# EAGLE schematic main (EAGLE 9.6.2)
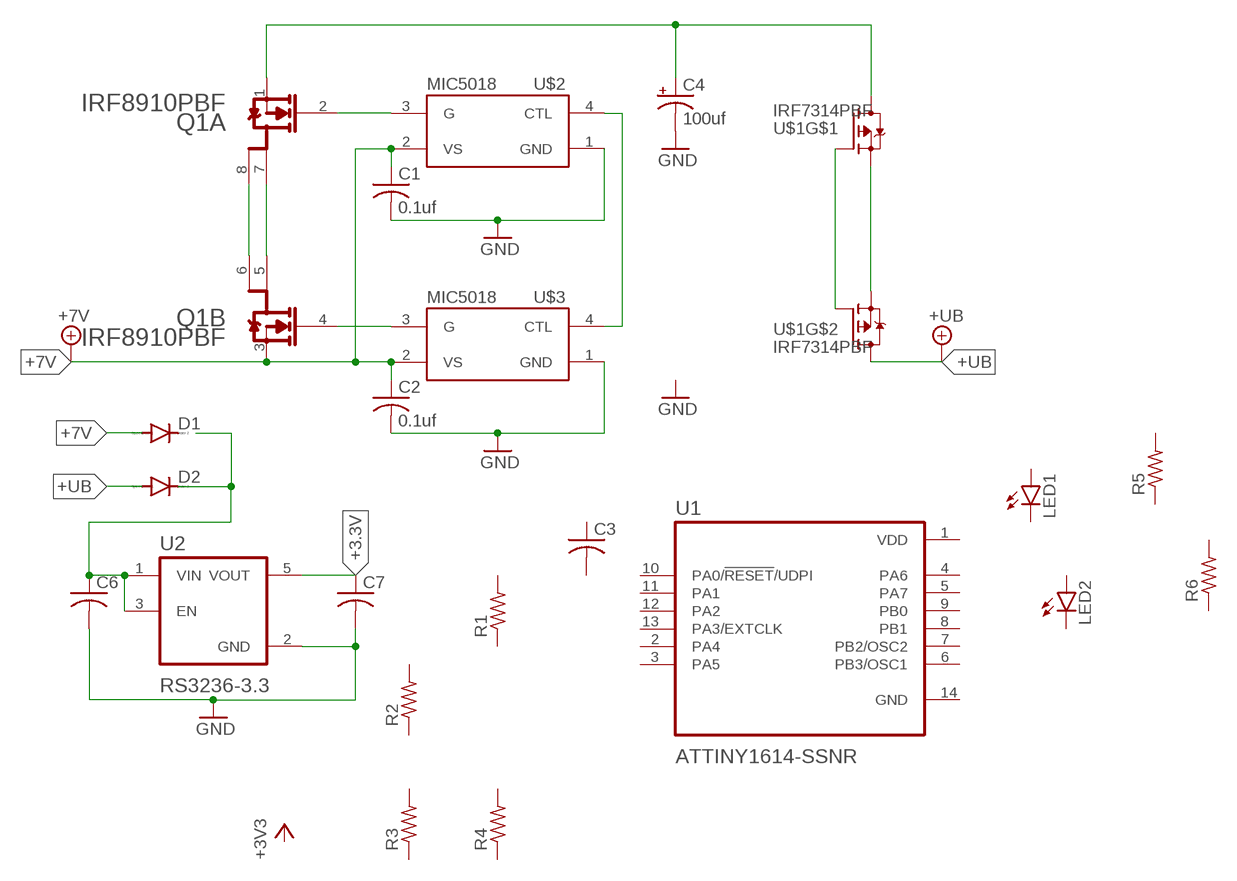
[diagram p0: schematic, sheet 1]

## Parts
C1  0.1uf  C-USC0805  [C0805]
C2  0.1uf  C-USC0805  [C0805]
C3  C-USC0805  [C0805]
C4  100uf  CPOL-US153CLV-0605  [153CLV-0605]
C6  C-USC1210  [C1210]
C7  C-USC1210  [C1210]
D1  DIODE-SOD323-W  [SOD323-W]
D2  DIODE-SOD323-W  [SOD323-W]
LED1  LED5MM  [LED5MM]
LED2  LED5MM  [LED5MM]
Q1  j  INFINEON_IRF8910PBFINFINEON_IRF8910PBF_0_0  [INFINEON_IRF8910PBF_0]
R1  R-US_R0805  [R0805]
R2  R-US_R0805  [R0805]
R3  R-US_R0805  [R0805]
R4  R-US_R0805  [R0805]
R5  R-US_R0805  [R0805]
R6  R-US_R0805  [R0805]
U1  ATTINY1614-SSNR  [SOIC127P600X175-14N]
U2  RS3236-3.3  AP2112K-3.3TRG1  [SOT95P285X140-5N]
U$1  IRF7314PBF  [SO-8]
U$2  MIC5018  [SOT143]
U$3  MIC5018  [SOT143]

## Nets
+3.3V: C7.1 U2.5(VOUT)
+7V: C1.1 C2.1 D1.A Q1.3(B:S2) U$2.2(VS) U$3.2(VS)
+UB: D2.A U$1.5(D) U$1.6(D)
GND: C1.2 C2.2 C4.- C6.2 C7.2 U2.2(GND) U$2.1(GND) U$3.1(GND)
N$1: C4.+ Q1.1(A:S1) U$1.7(D) U$1.8(D)
N$3: Q1.4(B:G2) U$3.3(G)
N$4: Q1.2(A:G1) U$2.3(G)
N$5: Q1.5(B:1_D2) Q1.7(A:1_D1)
N$6: Q1.6(B:2_D2) Q1.8(A:2_D1)
N$7: U$2.4(CTL) U$3.4(CTL)
N$8: U$1.1(S) U$1.3(S)
N$9: U$1.2(G) U$1.4(G)
N$10: C6.1 D2.C U2.1(VIN) U2.3(EN)
Unconnected: C3.1 C3.2 D1.C LED1.A LED1.K(C) LED2.A LED2.K(C) R1.1 R1.2 R2.1 R2.2 R3.1 R3.2 R4.1 R4.2 R5.1 R5.2 R6.1 R6.2 U1.2(PA4) U1.3(PA5) U1.4(PA6) U1.5(PA7) U1.6(PB3/OSC1) U1.7(PB2/OSC2) U1.8(PB1) U1.9(PB0) U1.10(PA0/!RESET!/UDPI) U1.11(PA1) U1.12(PA2) U1.13(PA3/EXTCLK)

## Power pins joined to a net without a drawn wire
GND: U1.14(GND)
VDD: U1.1(VDD)

## Library data of the parts
C1-C3 C6 C7 = rcl:C-US: CAPACITOR, American symbol; SPICEPREFIX: C
C4 = rcl:CPOL-US: POLARIZED CAPACITOR, American symbol; SPICEPREFIX: C
D1 D2 = diode:DIODE-: DIODE
LED1 LED2 = led:LED: LED OSRAM: - CHIPLED LG R971, LG N971, LY N971, LG Q971, LY Q971, LO R971, LY R971 LH N974, LH R974 LS Q976, LO Q976, LY Q976 LO Q996 - Hyper CHIPLED LW Q18S LB Q993, LB Q99A, LB R99A - SideLED LS A670, LO A670, LY A670, LG A670, LP A670 LB A673, LV A673, LT A673, LW A673 LH A674 LY A675 LS A676, LA A676, LO A676, LY A676, LW A676 LS A679, LY A679, LG A679 - Hyper Micro SIDELED® LS Y876, LA Y876, LO Y876, LY Y876 LT Y87S - SmartLED LW L88C, LW L88S LB L89C, LB L89S, LG L890 LS L89K, LO L89K, LY L89K LS L896, LA L896, LO L896, LY L896 - TOPLED LS T670, LO T670, LY T670, LG T670, LP T670 LSG T670, LSP T670, LSY T670, LOP T670, LYG T670 LG T671, LOG T671, LSG T671 LB T673, LV T673, LT T673, LW T673 LH T674 LS T676, LA T676, LO T676, LY T676, LB T676, LH T676, LSB T676, LW T676 LB T67C, LV T67C, LT T67C, LS T67K, LO T67K, LY T67K, LW E67C LS E67B, LA E67B, LO E67B, LY E67B, LB E67C, LV E67C, LT E67C LW T67C LS T679, LY T679, LG T679 LS T770, LO T770, LY T770, LG T770, LP T770 LB T773, LV T773, LT T773, LW T773 LH T774 LS E675, LA E675, LY E675, LS T675 LS T776, LA T776, LO T776, LY T776, LB T776 LHGB T686 LT T68C, LB T68C - Hyper Mini TOPLED® LB M676 - Mini TOPLED Santana® LG M470 LS M47K, LO M47K, LY M47K Source: http://www.osram.convergy.de LUXEON: - LUMILED® LXK2-PW12-R00, LXK2-PW12-S00, LXK2-PW14-U00, LXK2-PW14-V00 LXK2-PM12-R00, LXK2-PM12-S00, LXK2-PM14-U00 LXK2-PE12-Q00, LXK2-PE12-R00, LXK2-PE12-S00, LXK2-PE14-T00, LXK2-PE14-U00 LXK2-PB12-K00, LXK2-PB12-L00, LXK2-PB12-M00, LXK2-PB14-N00, LXK2-PB14-P00, LXK2-PB14-Q00 LXK2-PR12-L00, LXK2-PR12-M00, LXK2-PR14-Q00, LXK2-PR14-R00 LXK2-PD12-Q00, LXK2-PD12-R00, LXK2-PD12-S00 LXK2-PH12-R00, LXK2-PH12-S00 LXK2-PL12-P00, LXK2-PL12-Q00, LXK2-PL12-R00 Source: www.luxeon.com KINGBRIGHT: KA-3528ASYC Source: www.kingbright.com
Q1 = Infineon - IRF8910PBF:INFINEON_IRF8910PBF: Mosfet Array 2 N-Channel (Dual) 20V 10A 2W Surface Mount 8-SO; AUTOMOTIVE: No; CENTROID_NOT_SPECIFIED: No; CONTINUOUS_DRAIN_CURRENT: 10A; DATASHEET: https://www.infineon.com/dgdl/irf8910pbf.pdf?fileId=5546d462533600a401535610ec101d8d; DEPLETION_MODE: False; DEVICE_CLASS_L1: Discrete Semiconductors; DEVICE_CLASS_L2: Transistors; DEVICE_CLASS_L3: MOSFETs; DIGIKEY_DESCRIPTION: MOSFET 2N-CH 20V 10A 8-SOIC; DIGIKEY_PART_NUMBER: IRF8910PBF-ND; DRAIN_TO_SOURCE_BREAKDOWN_VOLTAGE: 20V; DRAIN_TO_SOURCE_RESISTANCE: 14.6mΩ; DRAIN_TO_SOURCE_VOLTAGE: 20V; FOOTPRINT_PARAMETERS_1: {"fp_type":"SOIC_narrow","params":{"N":{"nom":"8","long name":"Number of leads","min":null,"max":null,"short name":"N","type":"count"},"A":{"nom":false,"long name":"Height","min":1350000,"max":1750000,"short name":"A","type":"measurement"},"A1":{"nom":false,"long name":"Package clearance","min":100000,"max":250000,"short name":"A1","type":"measurement"},"A2":{"nom":false,"long name":"Package height","min":false,"max":1500000,"short name":"A2","type":"measurement"},"D":{"nom":false,"long name":"Package length","min":4800000,"max":5000000,"short name":"D","type":"measurement"},"E":{"nom":false,"long name":"Width w/ leads","min":5800000,"max":6200000,"short name":"E","type":"measurement"},"E1":{"nom":false,"long name":"Package width","min":3800000,"max":4000000,"short name":"E1","type":"measurement"},"B":{"nom":false,"long name":"Lead width","min":330000,"max":510000,"short name":"B","type":"measurement"},"C":{"nom":false,"long name":"Lead thickness","min":190000,"max":250000,"short name":"C","type":"measurement"},"e":{"nom":1270000,"long name":"Lead pitch","min":null,"max":null,"short name":"e","type":"measurement"},"L":{"nom":false,"long name":"Lead foot length","min":400000,"max":1270000,"short name":"L","type":"measurement"},"PHI":{"nom":false,"long name":"Lead foot angle","min":0,"max":8000000,"short name":"PHI","type":"measurement"},"HT":{"default":"No","long name":"Thermal pad","type":"multichoiceparent","short name":"HT","children":[]},"offset x":{"nom":0,"long name":"X Center offset","min":null,"max":null,"short name":"offset x","type":"measurement"},"offset y":{"nom":0,"long name":"Y Center offset","min":null,"max":null,"short name":"offset y","type":"measurement"},"LS":{"default":"Rounded rectangle","long name":"Land shape","type":"multichoice","short name":"LS"},"LS1":{"default":"Rectangle","long name":"Land shape (Pin 1)","type":"multichoice","short name":"LS1"},"solder toe":{"nom":550000,"long name":"Solder fillet (toe)","min":null,"max":null,"short name":"solder toe","type":"fixedmeasurement"},"solder heel":{"nom":450000,"long name":"Solder fillet (heel)","min":null,"max":null,"short name":"solder heel","type":"fixedmeasurement"},"solder side":{"nom":50000,"long name":"Solder fillet (side)","min":null,"max":null,"short name":"solder side","type":"fixedmeasurement"},"courtyard":{"nom":500000,"long name":"Courtyard","min":null,"max":null,"short name":"courtyard","type":"fixedmeasurement"},"SF":{"default":"A","long name":"Packing level","type":"multichoiceparent","short name":"SF","help":"http://support.upverter.com/customer/portal/articles/978783-what-is-a-footprint-packing-level","children":["solder toe","solder heel","solder side","courtyard"]}}}; FOOTPRINT_PARAMETERS_2: {"fp_type":"SOIC_narrow","params":{"N":{"nom":"8","long name":"Number of leads","min":null,"max":null,"short name":"N","type":"count"},"A":{"nom":false,"long name":"Height","min":1350000,"max":1750000,"short name":"A","type":"measurement"},"A1":{"nom":false,"long name":"Package clearance","min":100000,"max":250000,"short name":"A1","type":"measurement"},"A2":{"nom":false,"long name":"Package height","min":false,"max":1500000,"short name":"A2","type":"measurement"},"D":{"nom":false,"long name":"Package length","min":4800000,"max":5000000,"short name":"D","type":"measurement"},"E":{"nom":false,"long name":"Width w/ leads","min":5800000,"max":6200000,"short name":"E","type":"measurement"},"E1":{"nom":false,"long name":"Package width","min":3800000,"max":4000000,"short name":"E1","type":"measurement"},"B":{"nom":false,"long name":"Lead width","min":330000,"max":510000,"short name":"B","type":"measurement"},"C":{"nom":false,"long name":"Lead thickness","min":190000,"max":250000,"short name":"C","type":"measurement"},"e":{"nom":1270000,"long name":"Lead pitch","min":null,"max":null,"short name":"e","type":"measurement"},"L":{"nom":false,"long name":"Lead foot length","min":400000,"max":1270000,"short name":"L","type":"measurement"},"PHI":{"nom":false,"long name":"Lead foot angle","min":0,"max":8000000,"short name":"PHI","type":"measurement"},"HT":{"default":"No","long name":"Thermal pad","type":"multichoiceparent","short name":"HT","children":[]},"offset x":{"nom":0,"long name":"X Center offset","min":null,"max":null,"short name":"offset x","type":"measurement"},"offset y":{"nom":0,"long name":"Y Center offset","min":null,"max":null,"short name":"offset y","type":"measurement"},"LS":{"default":"Rounded rectangle","long name":"Land shape","type":"multichoice","short name":"LS"},"LS1":{"default":"Rectangle","long name":"Land shape (Pin 1)","type":"multichoice","short name":"LS1"},"solder toe":{"nom":350000,"long name":"Solder fillet (toe)","min":null,"max":null,"short name":"solder toe","type":"fixedmeasurement"},"solder heel":{"nom":350000,"long name":"Solder fillet (heel)","min":null,"max":null,"short name":"solder heel","type":"fixedmeasurement"},"solder side":{"nom":30000,"long name":"Solder fillet (side)","min":null,"max":null,"short name":"solder side","type":"fixedmeasurement"},"courtyard":{"nom":250000,"long name":"Courtyard","min":null,"max":null,"short name":"courtyard","type":"fixedmeasurement"},"SF":{"default":"B","long name":"Packing level","type":"multichoiceparent","short name":"SF","help":"http://support.upverter.com/customer/portal/articles/978783-what-is-a-footprint-packing-level","children":["solder toe","solder heel","solder side","courtyard"]}}}; FOOTPRINT_PARAMETERS_3: {"fp_type":"SOIC_narrow","params":{"N":{"nom":"8","long name":"Number of leads","min":null,"max":null,"short name":"N","type":"count"},"A":{"nom":false,"long name":"Height","min":1350000,"max":1750000,"short name":"A","type":"measurement"},"A1":{"nom":false,"long name":"Package clearance","min":100000,"max":250000,"short name":"A1","type":"measurement"},"A2":{"nom":false,"long name":"Package height","min":false,"max":1500000,"short name":"A2","type":"measurement"},"D":{"nom":false,"long name":"Package length","min":4800000,"max":5000000,"short name":"D","type":"measurement"},"E":{"nom":false,"long name":"Width w/ leads","min":5800000,"max":6200000,"short name":"E","type":"measurement"},"E1":{"nom":false,"long name":"Package width","min":3800000,"max":4000000,"short name":"E1","type":"measurement"},"B":{"nom":false,"long name":"Lead width","min":330000,"max":510000,"short name":"B","type":"measurement"},"C":{"nom":false,"long name":"Lead thickness","min":190000,"max":250000,"short name":"C","type":"measurement"},"e":{"nom":1270000,"long name":"Lead pitch","min":null,"max":null,"short name":"e","type":"measurement"},"L":{"nom":false,"long name":"Lead foot length","min":400000,"max":1270000,"short name":"L","type":"measurement"},"PHI":{"nom":false,"long name":"Lead foot angle","min":0,"max":8000000,"short name":"PHI","type":"measurement"},"HT":{"default":"No","long name":"Thermal pad","type":"multichoiceparent","short name":"HT","children":[]},"offset x":{"nom":0,"long name":"X Center offset","min":null,"max":null,"short name":"offset x","type":"measurement"},"offset y":{"nom":0,"long name":"Y Center offset","min":null,"max":null,"short name":"offset y","type":"measurement"},"LS":{"default":"Rounded rectangle","long name":"Land shape","type":"multichoice","short name":"LS"},"LS1":{"default":"Rectangle","long name":"Land shape (Pin 1)","type":"multichoice","short name":"LS1"},"solder toe":{"nom":150000,"long name":"Solder fillet (toe)","min":null,"max":null,"short name":"solder toe","type":"fixedmeasurement"},"solder heel":{"nom":250000,"long name":"Solder fillet (heel)","min":null,"max":null,"short name":"solder heel","type":"fixedmeasurement"},"solder side":{"nom":10000,"long name":"Solder fillet (side)","min":null,"max":null,"short name":"solder side","type":"fixedmeasurement"},"courtyard":{"nom":100000,"long name":"Courtyard","min":null,"max":null,"short name":"courtyard","type":"fixedmeasurement"},"SF":{"default":"C","long name":"Packing level","type":"multichoiceparent","short name":"SF","help":"http://support.upverter.com/customer/portal/articles/978783-what-is-a-footprint-packing-level","children":["solder toe","solder heel","solder side","courtyard"]}}}; FOOTPRINT_URL: https://www.infineon.com/cms/en/product/packages/PG-DSO/PG-DSO-8-902/; FOOTPRINT_VARIANT_NAME_0: Recommended_Land_Pattern; FOOTPRINT_VARIANT_NAME_1: IPC_A; FOOTPRINT_VARIANT_NAME_2: IPC_B; FOOTPRINT_VARIANT_NAME_3: IPC_C; GATE_CHARGE_AT_VGS: 7.4nC @ 4.5V; GATE_TO_SOURCE_VOLTAGE: 20V; HEIGHT: 1.75mm; INPUT_CAPACITACE_AT_VDS: 960pF @ 10V; LEAD_FREE: Yes; MAX_FORWARD_DIODE_VOLTAGE: 1V; MAX_JUNCTION_TEMP: +150°C; MF: Infineon; MFG_PACKAGE_IDENT: PG-DSO-8; MFG_PACKAGE_IDENT_COMPONENT_ID: 8fad051ce0ac8b36; MFG_PACKAGE_IDENT_DATE: 11/2006; MFG_PACKAGE_IDENT_REV: 902; MOUSER_PART_NUMBER: 942-IRF8910TRPBF; MPN: IRF8910PBF; NUMBER_OF_CHANNELS: 2; NUMBER_OF_N_CHANNELS: 2; PACKAGE: SOIC8; POWER_DISSIPATION: 2W; PREFIX: Q; PULSE_DRAIN_CURRENT: 82A; REVERSE_RECOVERY_CHARGE: 6.5nC; REVERSE_RECOVERY_TIME: 17ns; ROHS: Yes; RTHJA_MAX: 62.5°C/W; STANDOFF_HEIGHT: 0.1mm; TEMPERATURE_RANGE_HIGH: +150°C; TEMPERATURE_RANGE_LOW: -55°C; THRESHOLD_VGS_MAX: 2.55V; THRESHOLD_VGS_MIN: 1.65V; TURN_OFF_DELAY_TIME: 9.7ns; TURN_ON_DELAY_TIME: 6.2ns; VERIFICATION_VERSION: 0.0.0.3
R1-R6 = rcl:R-US_: RESISTOR, American symbol; SPICEPREFIX: R
U1 = ATTINY1614-SSNR:ATTINY1614-SSNR: 20MHz, SOIC, 85C, Green, 14 SOIC .150in T/R Check availability <https://pricing.snapeda.com/parts/ATTINY1614-SSNR/Microchip/view-part?ref=eda>; AVAILABILITY: In Stock; DESCRIPTION: AVR tinyAVR™ 1, Functional Safety (FuSa) Microcontroller IC 8-Bit 20MHz 16KB (16K x 8) FLASH 14-SOIC; MF: Microchip; MP: ATTINY1614-SSNR; PACKAGE: SO-14 Microchip; PRICE: None; PURCHASE-URL: https://pricing.snapeda.com/search/part/ATTINY1614-SSNR/?ref=eda
U2 = AP2112K-3.3TRG1:AP2112K-3.3TRG1: AP2112 Series 0.6 A 3.3 V Fixed Output SMT LDO Linear Regulator - SOT23-5 Check availability <https://pricing.snapeda.com/parts/AP2112K-3.3TRG1/Diodes%20Inc./view-part?ref=eda>; AVAILABILITY: In Stock; DESCRIPTION: Linear Voltage Regulator IC Positive Fixed 1 Output 600mA SOT-25; MF: Diodes Inc.; MP: AP2112K-3.3TRG1; PACKAGE: SOT-753 Diodes Inc.; PRICE: None; PURCHASE-URL: https://pricing.snapeda.com/search/part/AP2112K-3.3TRG1/?ref=eda
U$1 = IRF7314PBF:IRF7314PBF: Check availability <https://pricing.snapeda.com/parts/IRF7314PBF/Infineon/view-part?ref=eda>; AVAILABILITY: In Stock; DESCRIPTION: Mosfet Array 2 P-Channel (Dual) 20V 5.3A 2W Surface Mount 8-SO; MF: Infineon; MP: IRF7314PBF; PACKAGE: SOIC-8 International Rectifier; PRICE: None; PURCHASE-URL: https://pricing.snapeda.com/search/part/IRF7314PBF/?ref=eda
U$2 U$3 = CustomParts:MIC5018